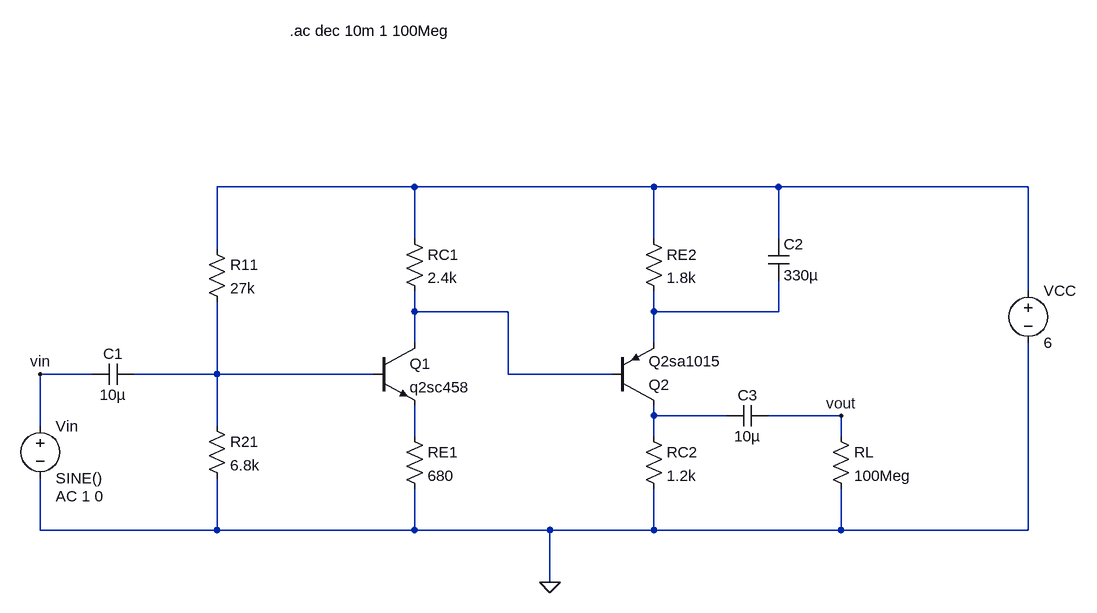
[diagram p0: schematic 3-2.asc]
3-2.asc, the LTspice schematic file:
Version 4
SHEET 1 1496 680
WIRE 480 -48 176 -48
WIRE 848 -48 480 -48
WIRE 1040 -48 848 -48
WIRE 1424 -48 1040 -48
WIRE 480 32 480 -48
WIRE 848 32 848 -48
WIRE 1040 32 1040 -48
WIRE 176 48 176 -48
WIRE 1424 112 1424 -48
WIRE 480 144 480 112
WIRE 624 144 480 144
WIRE 848 144 848 112
WIRE 1040 144 1040 96
WIRE 1040 144 848 144
WIRE 480 192 480 144
WIRE 848 192 848 144
WIRE -16 240 -96 240
WIRE 176 240 176 128
WIRE 176 240 48 240
WIRE 416 240 176 240
WIRE 624 240 624 144
WIRE 784 240 624 240
WIRE 848 304 848 288
WIRE 960 304 848 304
WIRE 1136 304 1024 304
WIRE -96 320 -96 240
WIRE 176 320 176 240
WIRE 480 336 480 288
WIRE 848 336 848 304
WIRE 1136 336 1136 304
WIRE -96 480 -96 400
WIRE 176 480 176 400
WIRE 176 480 -96 480
WIRE 480 480 480 416
WIRE 480 480 176 480
WIRE 688 480 480 480
WIRE 848 480 848 416
WIRE 848 480 688 480
WIRE 1136 480 1136 416
WIRE 1136 480 848 480
WIRE 1424 480 1424 192
WIRE 1424 480 1136 480
WIRE 688 560 688 480
FLAG 688 560 0
FLAG 1136 304 vout
FLAG -96 240 vin
SYMBOL voltage -96 304 R0
WINDOW 123 24 124 Left 2
WINDOW 39 0 0 Left 0
SYMATTR Value2 AC 1 0
SYMATTR InstName Vin
SYMATTR Value SINE()
SYMBOL cap 48 224 R90
WINDOW 0 0 32 VBottom 2
WINDOW 3 32 32 VTop 2
SYMATTR InstName C1
SYMATTR Value 10µ
SYMBOL res 160 32 R0
SYMATTR InstName R11
SYMATTR Value 27k
SYMBOL res 160 304 R0
SYMATTR InstName R21
SYMATTR Value 6.8k
SYMBOL res 464 16 R0
SYMATTR InstName RC1
SYMATTR Value 2.4k
SYMBOL npn 416 192 R0
SYMATTR InstName Q1
SYMATTR Value q2sc458
SYMBOL res 464 320 R0
SYMATTR InstName RE1
SYMATTR Value 680
SYMBOL pnp 784 288 M180
SYMATTR InstName Q2
SYMATTR Value Q2sa1015
SYMBOL res 832 320 R0
SYMATTR InstName RC2
SYMATTR Value 1.2k
SYMBOL cap 1024 288 R90
WINDOW 0 0 32 VBottom 2
WINDOW 3 32 32 VTop 2
SYMATTR InstName C3
SYMATTR Value 10µ
SYMBOL res 1120 320 R0
SYMATTR InstName RL
SYMATTR Value 100Meg
SYMBOL res 832 16 R0
SYMATTR InstName RE2
SYMATTR Value 1.8k
SYMBOL cap 1024 32 R0
SYMATTR InstName C2
SYMATTR Value 330µ
SYMBOL voltage 1424 96 R0
WINDOW 123 0 0 Left 0
WINDOW 39 0 0 Left 0
SYMATTR InstName VCC
SYMATTR Value 6
TEXT 288 -288 Left 2 !.ac dec 10m 1 100Meg

The netlist it stands for:
* 3-2.asc
Vin vin 0 SINE() AC 1 0
C1 N004 vin 10µ
R11 N001 N004 27k
R21 N004 0 6.8k
RC1 N001 N002 2.4k
Q1 N002 N004 N006 0 q2sc458
RE1 N006 0 680
Q2 N005 N002 N003 0 Q2sa1015
RC2 N005 0 1.2k
C3 vout N005 10µ
RL vout 0 100Meg
RE2 N001 N003 1.8k
C2 N001 N003 330µ
VCC N001 0 6
.model NPN NPN
.model PNP PNP
.lib standard.bjt
.ac dec 10m 1 100Meg
.backanno
.end